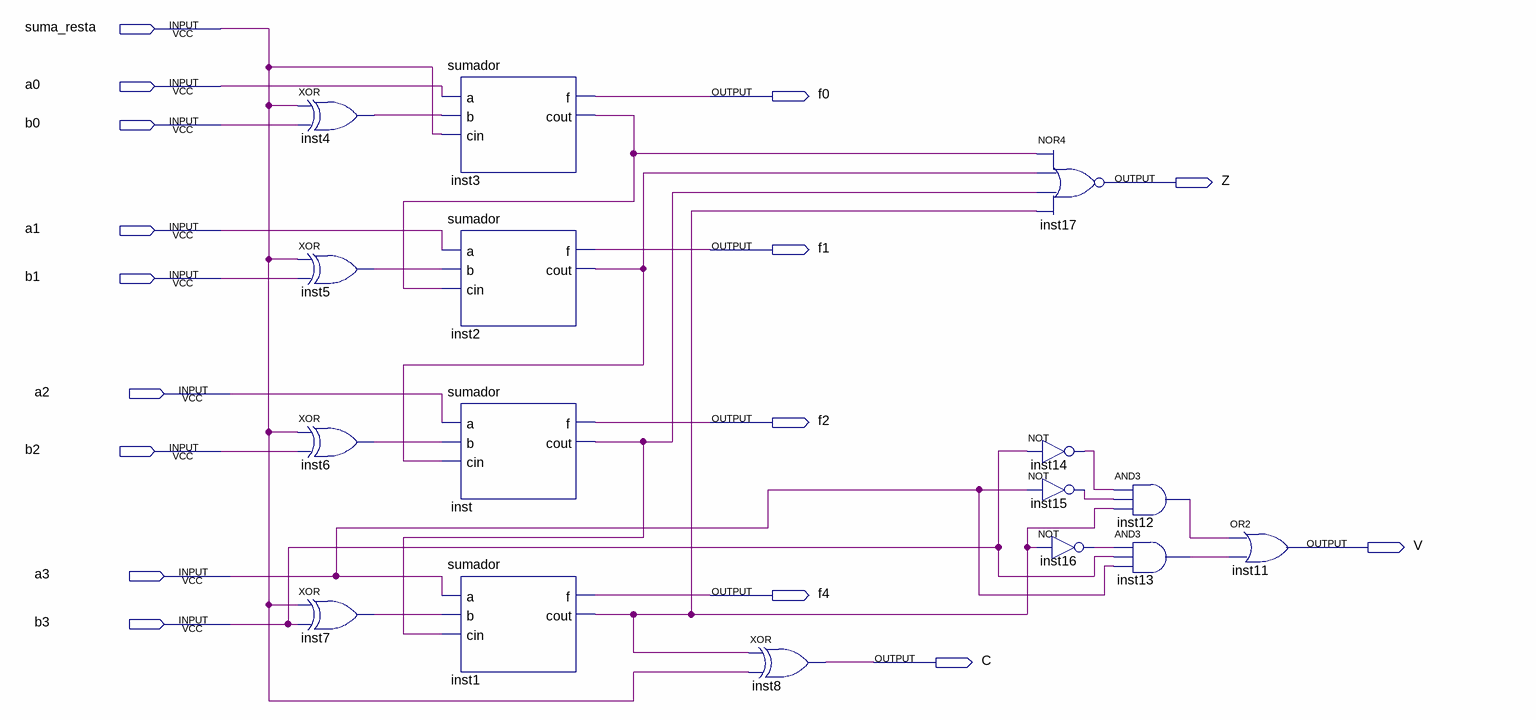
[diagram p0: schematic sheet]
// Quartus schematic sumador_completo.bdf as structural Verilog: 16 symbols, 16 pins
module sumador_completo (
  input  suma_resta,
  input  a0,
  input  b0,
  input  a1,
  input  b1,
  input  a2,
  input  b2,
  input  a3,
  input  b3,
  output f0,
  output Z,
  output f1,
  output f2,
  output V,
  output f4,
  output C
);

  wire inst1_cout, inst2_cout, inst3_cout, inst4_out, inst5_out, inst6_out, inst7_out, inst12_out,
       inst13_out, inst14_out, inst15_out, inst16_out, inst_cout;

  xor inst4 (inst4_out, suma_resta, b0);
  xor inst5 (inst5_out, suma_resta, b1);
  xor inst6 (inst6_out, suma_resta, b2);
  xor inst7 (inst7_out, suma_resta, b3);
  sumador inst3 (.a(a0), .b(inst4_out), .cin(suma_resta), .f(f0), .cout(inst3_cout));
  sumador inst2 (.a(a1), .b(inst5_out), .cin(inst3_cout), .f(f1), .cout(inst2_cout));
  sumador inst (.a(a2), .b(inst6_out), .cin(inst2_cout), .f(f2), .cout(inst_cout));
  sumador inst1 (.a(a3), .b(inst7_out), .cin(inst_cout), .f(f4), .cout(inst1_cout));
  xor inst8 (C, inst1_cout, suma_resta);
  nor inst17 (Z, inst3_cout, inst2_cout, inst_cout, inst1_cout);
  not inst14 (inst14_out, b3);
  not inst15 (inst15_out, a3);
  not inst16 (inst16_out, inst1_cout);
  and inst12 (inst12_out, inst14_out, inst15_out, inst1_cout);
  and inst13 (inst13_out, inst16_out, b3, a3);
  or inst11 (V, inst12_out, inst13_out);
endmodule
